# Altium project Problem_2.PrjPcb
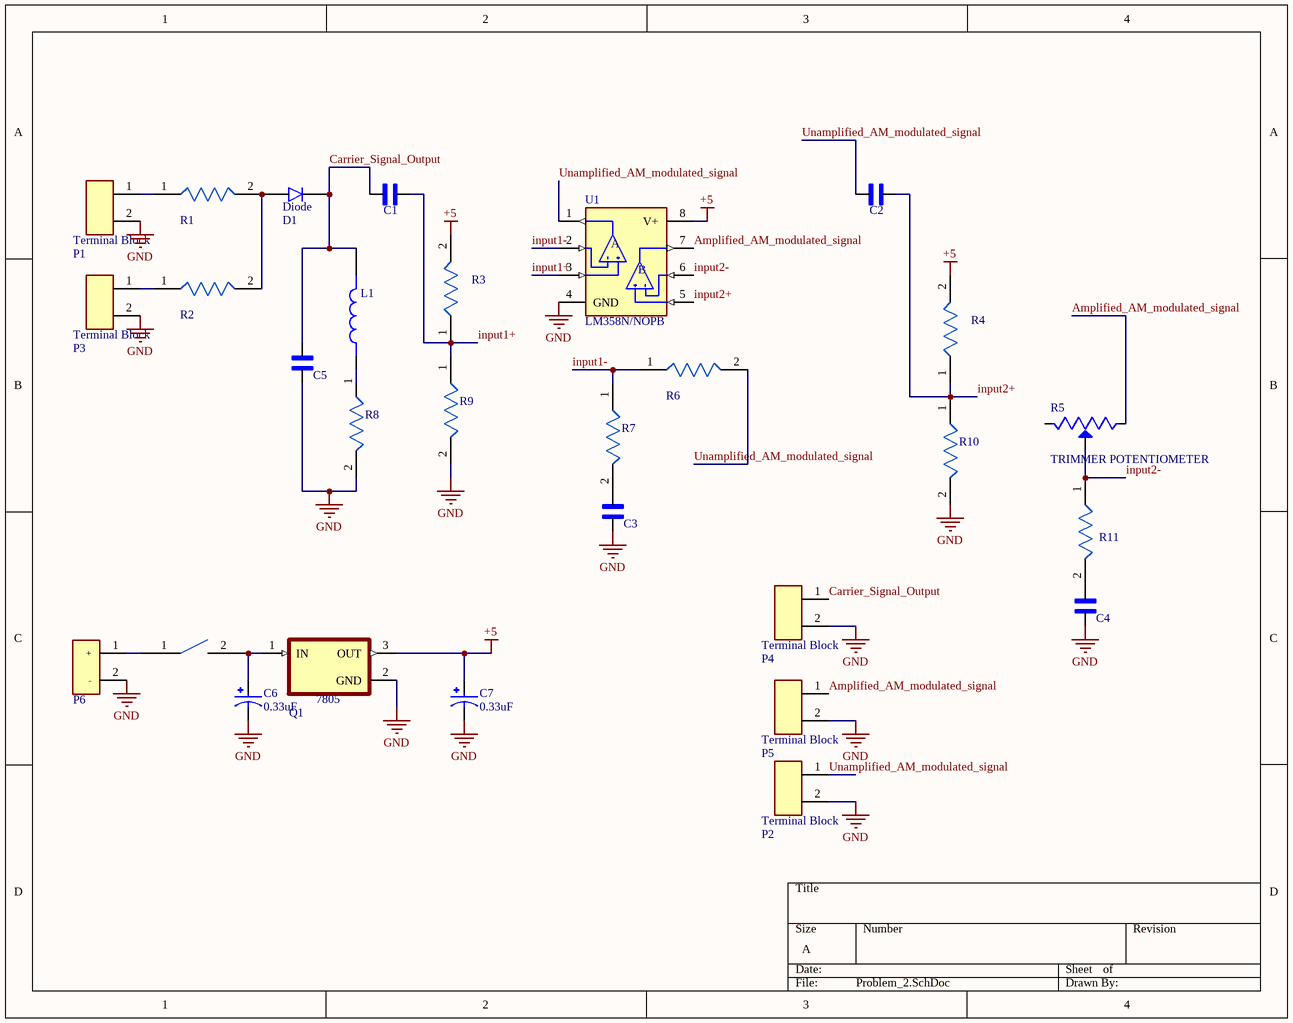
[diagram p0: Problem_2.SchDoc]
1 sheet, 29 parts. Net scope: global (net labels, ports and power ports of the same name join across sheets).
Board file: Problem_2.PcbDoc

## Sheet Problem_2.SchDoc
size A; SheetNumber: 1; SheetTotal: 1

### Parts
*  Switch  [Switch]  (value not drawn)
C1  Capacitor (10uF)  [Capacitor (10uF)]  (value not drawn)
C2  Capacitor (10uF)  [Capacitor (10uF)]  (value not drawn)
C3  Capacitor (10uF)  [Capacitor (10uF)]  (value not drawn)
C4  Capacitor (10uF)  [Capacitor (10uF)]  (value not drawn)
C5  Capacitor (10uF)  [Capacitor (10uF)]  (value not drawn)
C6  0.33uF  [Capacitor (Polar)]
C7  0.33uF  [Capacitor (Polar)]
D1  Diode  [Diode]  (value not drawn)
L1  Inductor  [Inductor]  (value not drawn)
P1  Terminal Block 2 Pin  [Terminal Block 2 Pin]  (value not drawn)
P2  Terminal Block 2 Pin  [Terminal Block 2 Pin]  (value not drawn)
P3  Terminal Block 2 Pin  [Terminal Block 2 Pin]  (value not drawn)
P4  (no value)  [Terminal Block 2 Pin]
P5  (no value)  [Terminal Block 2 Pin]
P6  HEADER, 2 PINS  [XT60 Male]  (value not drawn)
Q1  LM7805CT/NOPB  [LM7805CT/NOPB - duplicate]  (value not drawn)
R1  Resistor (10k)  [Resistor (10k)]  (value not drawn)
R2  Resistor (10k)  [Resistor (10k)]  (value not drawn)
R3  Resistor (4.7k)  [Resistor (4.7k)]  (value not drawn)
R4  Resistor (4.7k)  [Resistor (4.7k)]  (value not drawn)
R5  TRIMMER POTENTIOMETER  [Potentiometer (trimmer)]
R6  Resistor (4.7k)  [Resistor (4.7k)]  (value not drawn)
R7  Resistor (1k)  [Resistor (1k)]  (value not drawn)
R8  Resistor (0.5R)  [Resistor (0.5R)]  (value not drawn)
R9  Resistor (4.7k)  [Resistor (4.7k)]  (value not drawn)
R10  Resistor (4.7k)  [Resistor (4.7k)]  (value not drawn)
R11  Resistor (1k)  [Resistor (1k)]  (value not drawn)
U1  LM358N/NOPB  [LM358N]

### Nets
+5: C7.P Q1.3(OUT) R3.2 R4.2 U1.8(V+)
GND: C3.2 C4.1 C5.2 C6.N C7.N P1.2 P2.2 P3.2 P4.2 P5.2 P6.2(-) Q1.2(GND) R8.2 R9.2 R10.2 U1.4(GND)
Amplified_AM_modulated_signal: P5.1 R5.1(CCW) U1.7(OUTB)
Carrier_Signal_Output: C1.1 C5.1 D1.2(Cathode) L1.2 P4.1
input1+: C1.2 R3.1 R9.1 U1.3(+INA)
input1-: R6.1 R7.1 U1.2(-INA)
input2+: C2.1 R4.1 R10.1 U1.5(+INB)
input2-: R5.2(WIPER) R11.1 U1.6(-INB)
Unamplified_AM_modulated_signal: C2.2 P2.1 R6.2 U1.1(OUTA)
Net*_1: *.1 P6.1(+)
Net*_2: *.2 C6.P Q1.1(IN)
NetC3_1: C3.1 R7.2
NetC4_2: C4.2 R11.2
NetD1_1: D1.1(Anode) R1.2 R2.2
NetL1_1: L1.1 R8.1
NetP1_1: P1.1 R1.1
NetP3_1: P3.1 R2.1

Not connected (* = marked no-connect by the designer): R5 3(CW)

### Notes on the sheet
- (in symbol LM358N/NOPB) A; B
- (in symbol LM7805CT/NOPB) 7805
- (in symbol Terminal Block 2 Pin) Terminal Block

### Library data of the parts
* = Switch: Rocker Switch
C1-C5 = Capacitor (10uF): 10 ÂµF Â±10% 50V Ceramic Capacitor X7S Radial; MF: TDK; MP: FG20X7S1H106KRT06; SnapEDA_Link: https://www.snapeda.com/parts/FG20X7S1H106KRT06/TDK/view-part/?ref=snap; Package: RADIAL-2 TDK; Value: *; Check_prices: https://www.snapeda.com/parts/FG20X7S1H106KRT06/TDK/view-part/?ref=eda
C6 C7 = Capacitor (Polar): CAP ALUM 1UF 20% 50V RADIAL; MP: EEU-EB1H1R0SB; MF: Panasonic Electronic Components; Package: RADIAL-2 Panasonic; Price: None; Availability: Not in stock; Check_prices: https://www.snapeda.com/parts/EEU-EB1H1R0SB/Panasonic/view-part/6222296/?ref=eda; SnapEDA_Link: https://www.snapeda.com/parts/EEU-EB1H1R0SB/Panasonic/view-part/6222296/?ref=snap; Value: *
D1 = Diode: 1N-4148
L1 = Inductor: Inductor, 25.36Uh; MF: Triad Magnetics; MP: FIT50-1; SnapEDA_Link: https://www.snapeda.com/parts/FIT50-1/Triad+Magnetics/view-part/?ref=snap; Package: None; Value: *; Check_prices: https://www.snapeda.com/parts/FIT50-1/Triad+Magnetics/view-part/?ref=eda
P1-P5 = Terminal Block 2 Pin: 2 pin; MF: TE Connectivity; MP: 282837-2; SnapEDA_Link: https://www.snapeda.com/parts/282837-2/TE+Connectivity+AMP+Connectors/view-part/?ref=snap; Price: None; Check_prices: https://www.snapeda.com/parts/282837-2/TE+Connectivity+AMP+Connectors/view-part/?ref=eda; Purchase-URL: https://pricing.snapeda.com/search/part/282837-2/?ref=eda; Value: *; Availability: In Stock; Package: None
P6 = XT60 MALE: CONNECTOR
Q1 = LM7805CT/NOPB: 1.5-A, 30-V, linear voltage regulator; MF: Comset Semiconductors; Price: None; Availability: Not in stock; MP: LM7805CT; Package: TO-220 Comset Semiconductors; SnapEDA_Link: https://www.snapeda.com/parts/LM7805CT/Comset+Semiconductors/view-part/?ref=snap; Check_prices: https://www.snapeda.com/parts/LM7805CT/Comset+Semiconductors/view-part/?ref=eda; Value: *
R5 = TRIMMER POTENTIOMETER: VARIABLE RESISTOR
U1 = LM358N/NOPB: General Purpose Amplifier 2 Circuit - 8-PDIP; MF: ON Semiconductor; SnapEDA_Link: https://www.snapeda.com/parts/LM358N/Onsemi/view-part/?ref=snap; Package: PDIP-8 ON Semiconductor; Value: *; MP: LM358N; Check_prices: https://www.snapeda.com/parts/LM358N/Onsemi/view-part/?ref=eda